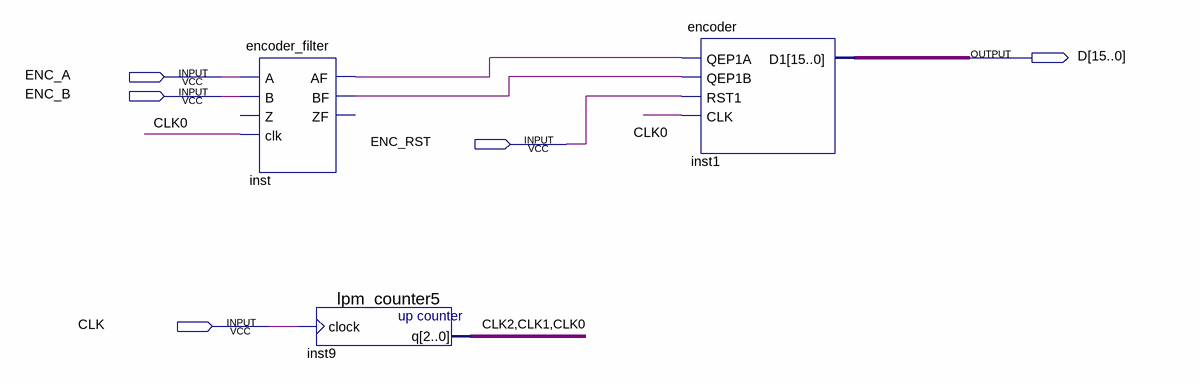
[diagram p0: schematic sheet]
// Quartus schematic encoder_module.bdf as structural Verilog: 3 symbols, 5 pins
module encoder_module (
  input  ENC_A,
  input  ENC_B,
  input  ENC_RST,
  input  CLK,
  output [15:0] D
);

  wire CLK0, CLK1, CLK2, inst_af, inst_bf;

  encoder_filter inst (.A(ENC_A), .B(ENC_B), .clk(CLK0), .AF(inst_af), .BF(inst_bf));  // open: Z, ZF
  lpm_counter5 inst9 (.clock(CLK), .q({CLK2, CLK1, CLK0}));
  encoder inst1 (.QEP1A(inst_af), .QEP1B(inst_bf), .RST1(ENC_RST), .CLK(CLK0), .D1(D));
endmodule
